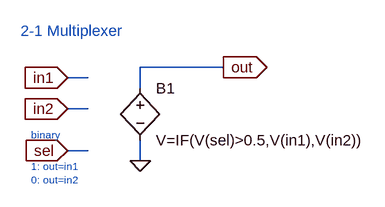
[diagram p0: schematic MUX.asc]
MUX.asc, the LTspice schematic file:
Version 4
SHEET 1 880 680
WIRE 336 16 208 16
WIRE 128 32 96 32
WIRE 208 48 208 16
WIRE 128 80 96 80
WIRE 128 144 96 144
WIRE 208 160 208 128
FLAG 96 32 in1
IOPIN 96 32 In
FLAG 96 80 in2
IOPIN 96 80 In
FLAG 96 144 sel
IOPIN 96 144 In
FLAG 336 16 out
IOPIN 336 16 Out
FLAG 208 160 0
SYMBOL bv 208 32 R0
SYMATTR InstName B1
SYMATTR Value V=IF(V(sel)>0.5,V(in1),V(in2))
TEXT 24 -40 Left 2 ;2-1 Multiplexer
TEXT 40 120 Left 1 ;binary
TEXT 40 168 Left 1 ;1: out=in1\n0: out=in2

The netlist it stands for:
* MUX.asc
B1 out 0 V=IF(V(sel)>0.5,V(in1),V(in2))
* 2-1 Multiplexer
* binary
* 1: out=in1
* 0: out=in2
.backanno
.end